# EAGLE design 5vdcdc 2.0 (EAGLE 7.2.0)
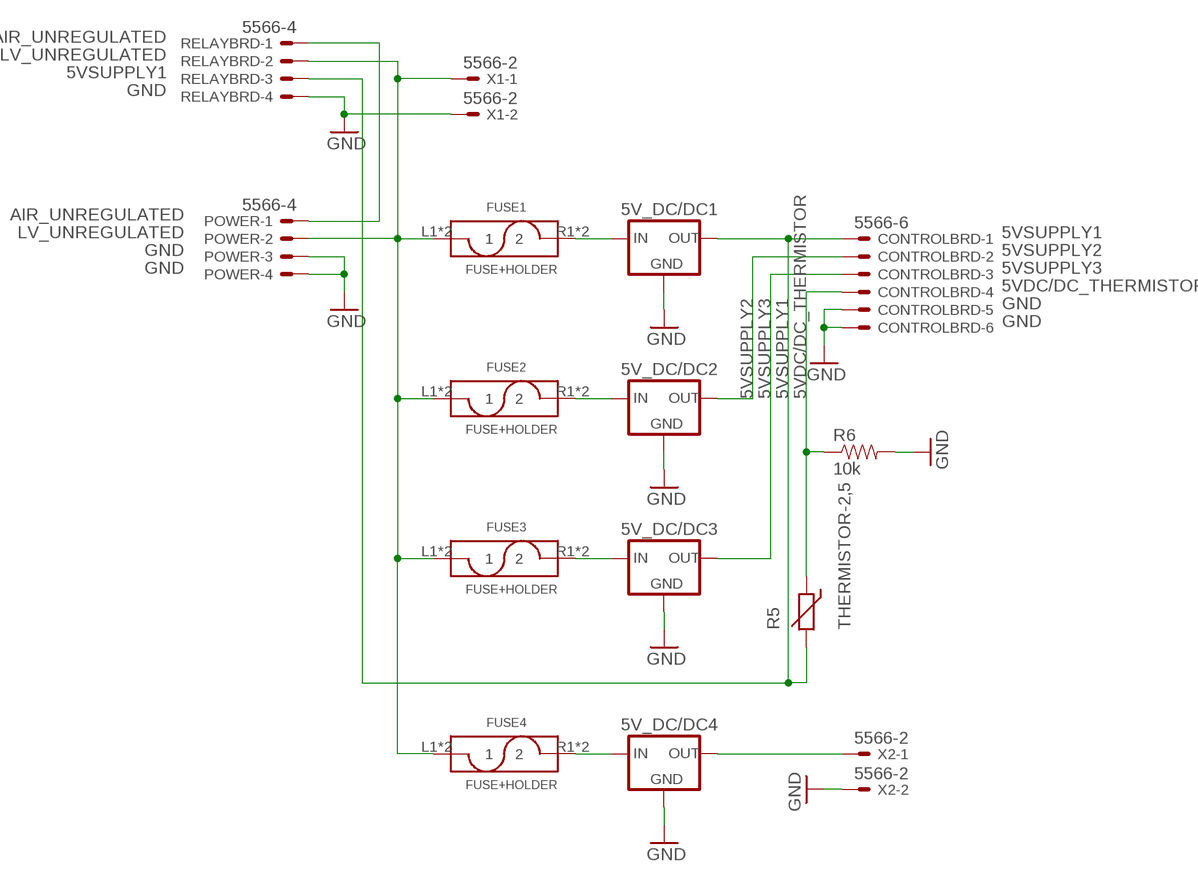
[diagram p0: schematic, sheet 1]

## Parts
5V_DC/DC1  5V_REGULATORLINEAR  [TO-220-SINK]
5V_DC/DC2  5V_REGULATORLINEAR  [TO-220-SINK]
5V_DC/DC3  5V_REGULATORLINEAR  [TO-220-SINK]
5V_DC/DC4  5V_REGULATORLINEAR  [TO-220-SINK]
CONTROLBRD  5566-6  [5566-6]
FUSE1  FUSE+HOLDER  [FUSE-HOLDER]
FUSE2  FUSE+HOLDER  [FUSE-HOLDER]
FUSE3  FUSE+HOLDER  [FUSE-HOLDER]
FUSE4  FUSE+HOLDER  [FUSE-HOLDER]
POWER  5566-4  [5566-4]
R5  THERMISTOR-2,5  [RS-2,5]
R6  10k  RESISTORAXIAL-0.3  [AXIAL-0.3]
RELAYBRD  5566-4  [5566-4]
X1  5566-2  [5566-2]
X2  5566-2  [5566-2]

## Nets
5VDC/DC_THERMISTOR: CONTROLBRD.4 R5.1 R6.P$1
5VSUPPLY1: 5V_DC/DC1.3(OUT) CONTROLBRD.1 R5.2 RELAYBRD.3
5VSUPPLY2: 5V_DC/DC2.3(OUT) CONTROLBRD.2
5VSUPPLY3: 5V_DC/DC3.3(OUT) CONTROLBRD.3
AIR_UNREGULATED: POWER.1 RELAYBRD.1
GND: 5V_DC/DC1.2(GND) 5V_DC/DC2.2(GND) 5V_DC/DC3.2(GND) 5V_DC/DC4.2(GND) CONTROLBRD.5 CONTROLBRD.6 POWER.3 POWER.4 R6.P$2 RELAYBRD.4 X1.2 X2.2
LV_UNREGULATED: FUSE1.L1 FUSE1.L2 FUSE2.L1 FUSE2.L2 FUSE3.L1 FUSE3.L2 FUSE4.L1 FUSE4.L2 POWER.2 RELAYBRD.2 X1.1
N$1: 5V_DC/DC1.1(IN) FUSE1.R1 FUSE1.R2
N$2: 5V_DC/DC2.1(IN) FUSE2.R1 FUSE2.R2
N$3: 5V_DC/DC3.1(IN) FUSE3.R1 FUSE3.R2
N$5: 5V_DC/DC4.1(IN) FUSE4.R1 FUSE4.R2
N$6: 5V_DC/DC4.3(OUT) X2.1

## Library data of the parts
5V_DC/DC1-5V_DC/DC4 = HyTech 2016:5V_REGULATOR: Voltage Regulator Switching 5v regulator Datasheet <http://power.murata.com/data/power/oki-78sr.pdf> Standard 7805 5V regulator. IGO (Input Ground Output). Spark Fun Electronics SKU : COM-00107 Datasheet <http://www.mouser.com/ds/2/308/MC7800-D-94905.pdf>
CONTROLBRD = con-molex:5566-6: Mini FIT connector 6 pol Source: http://www.molex.com; MPN: 95566-61002; OC_FARNELL: unknown; OC_NEWARK: 22K8620
FUSE1-FUSE4 = HyTech 2016:FUSE+HOLDER
POWER RELAYBRD = con-molex:5566-4: Mini FIT connector 4 pol Source: http://www.molex.com; OC_FARNELL: unknown; OC_NEWARK: unknown
R5 = varistor:THERMISTOR: THERMISTOR
R6 = HyTech 2016:RESISTOR: Resistor Basic schematic elements and footprints for 0603, 1206, and PTH resistors.
X1 X2 = con-molex:5566-2: Mini FIT connector 2 pol Source: http://www.molex.com; OC_FARNELL: 1822072; OC_NEWARK: unknown

## Board
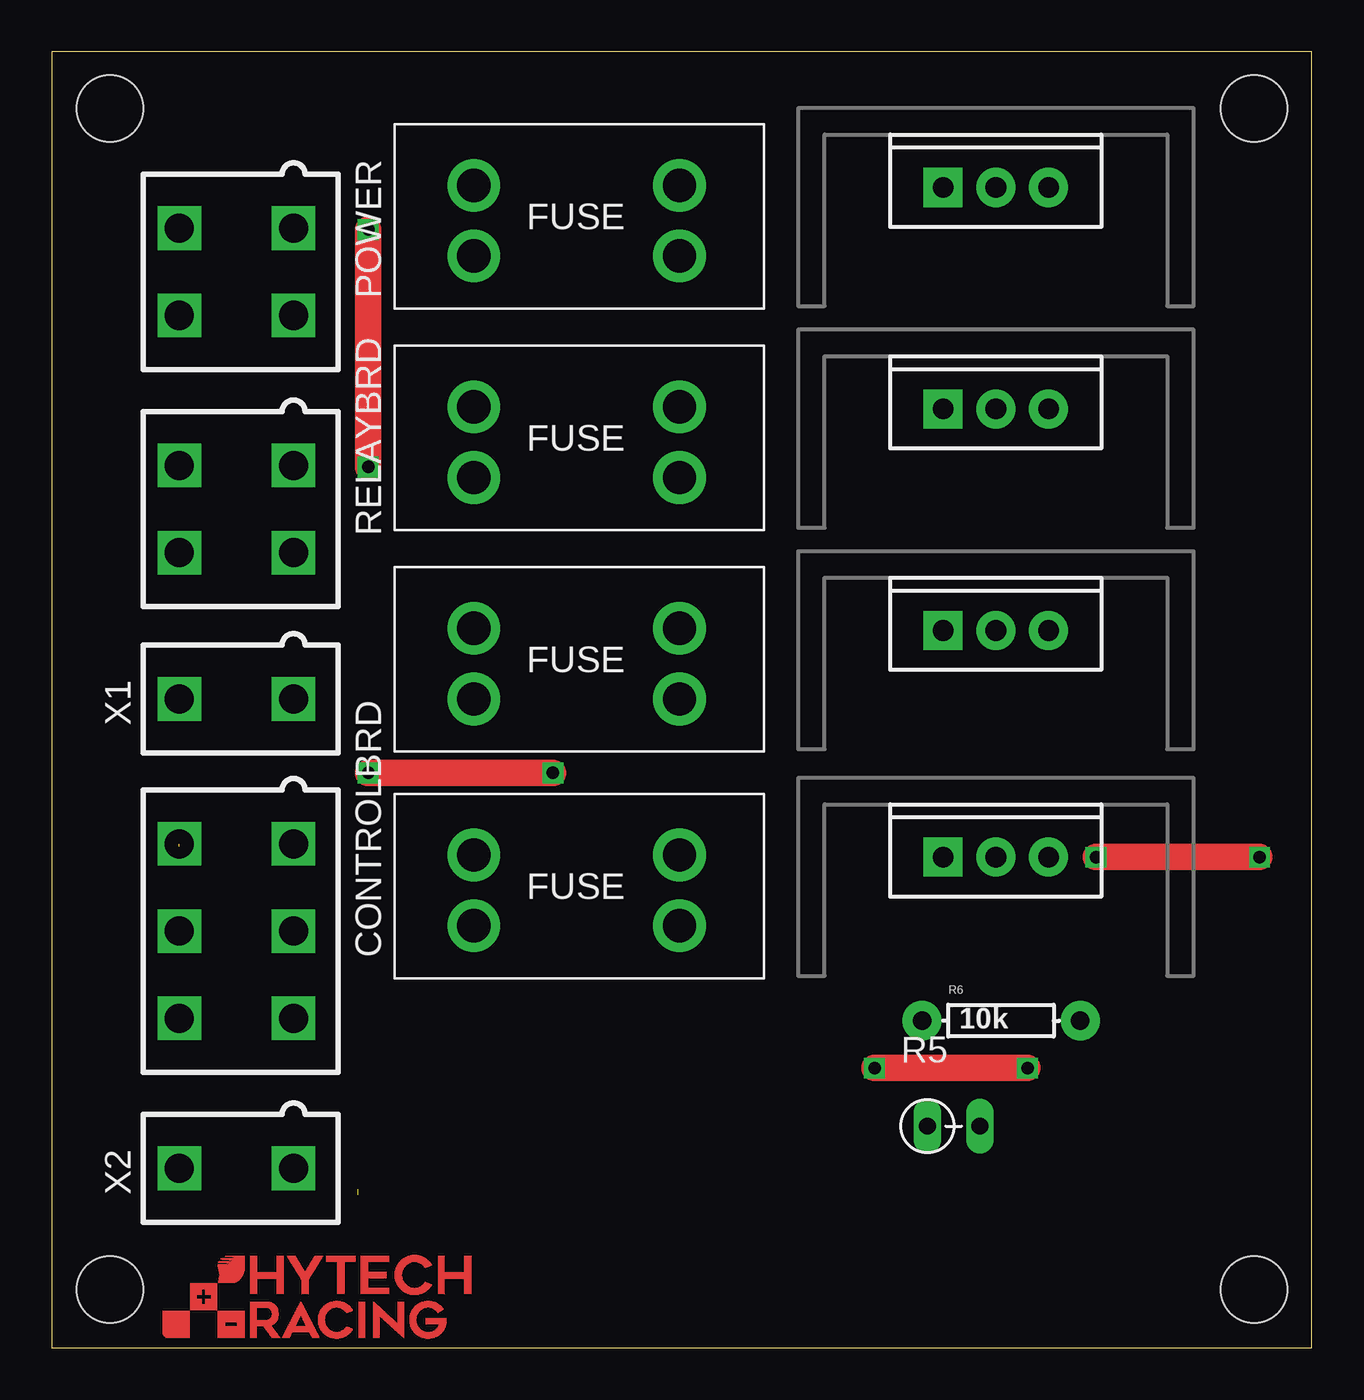
[diagram p1: board, top side]
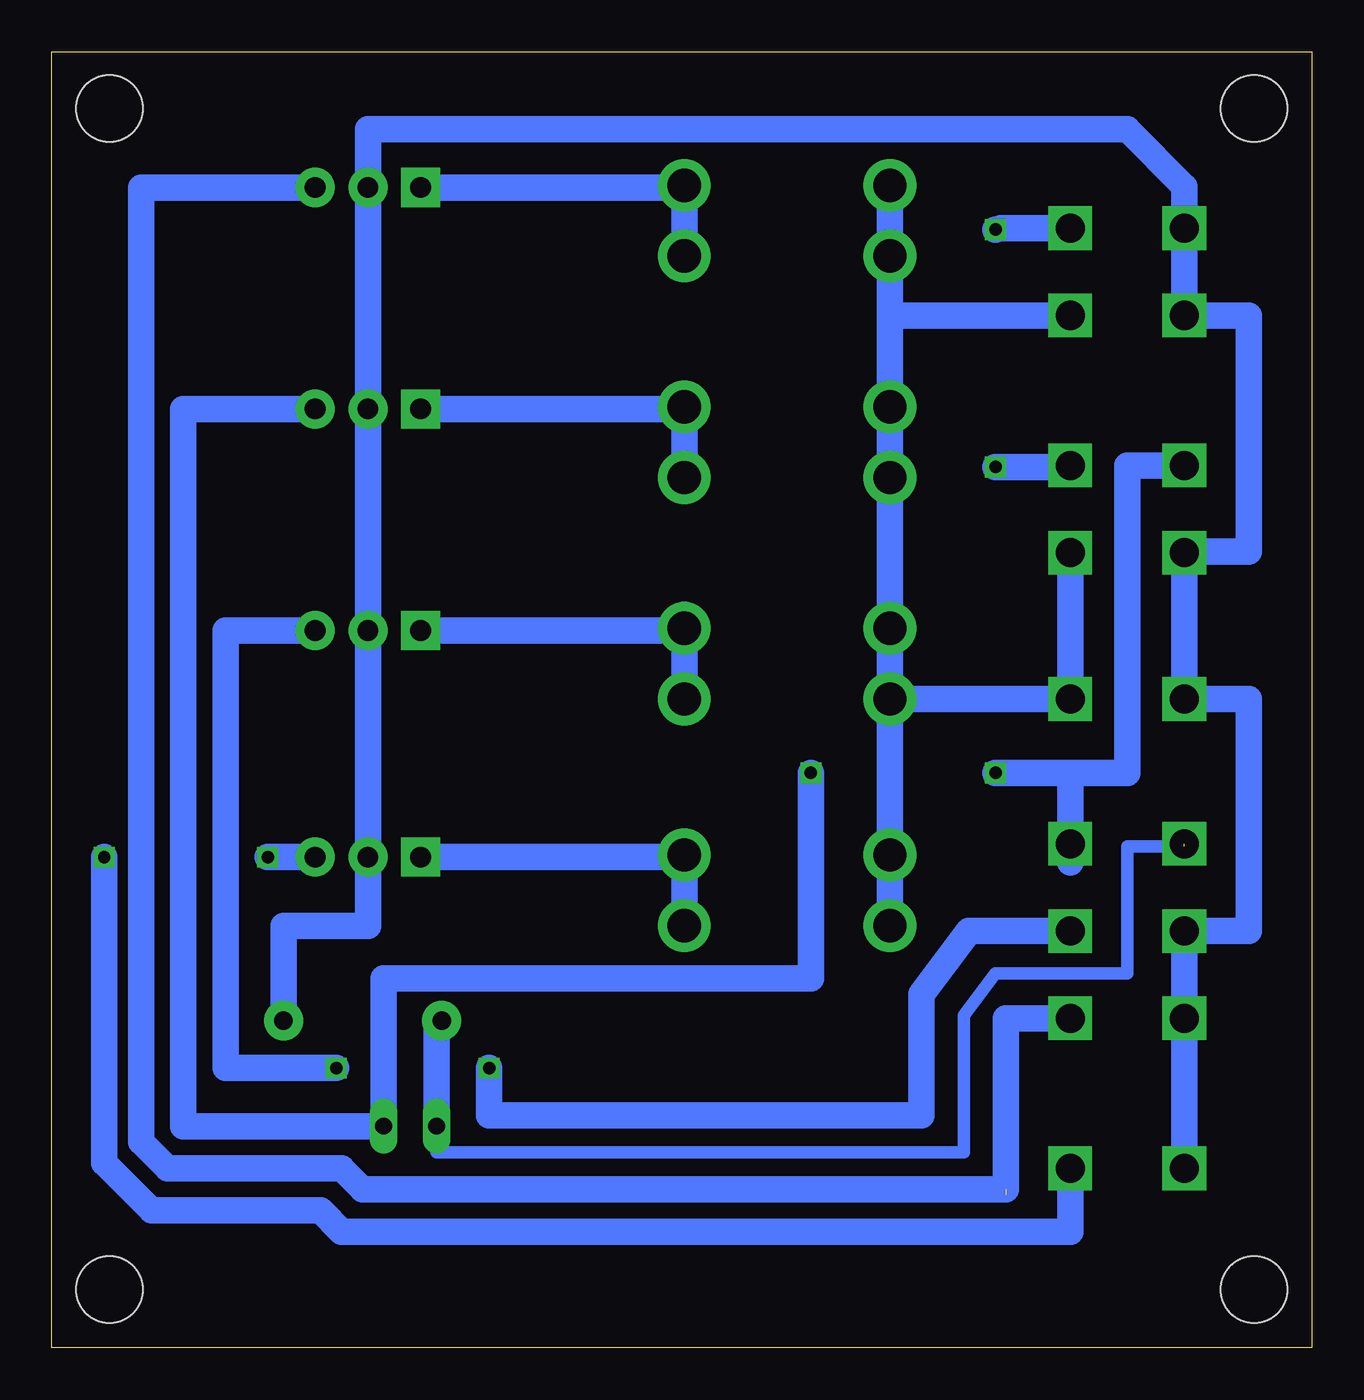
[diagram p2: board, bottom side, seen from below]

Size 60.69 x 62.41 mm. Coordinates in mm from the lower left corner, seen from the top.
Outline: 0,0 60.69,0 60.69,62.41 0,62.41 0,0
Copper layers (1*16): Top 0.035mm / dielectric 1.5mm / Bottom 0.035mm
Design rules "default": minimum track width 10mil, minimum drill 24mil, track to track 8mil, track to pad 8mil, pad to pad 8mil, via to via 8mil, smd to smd 8mil, copper to edge 40mil, drill to drill 8mil, minimum pad ring 10mil, minimum via ring 8mil, stop-mask expansion 4mil, vias tented up to drill 0mil, thermal gap 10mil
Holes 3.2 mm at 2.79,59.69 57.91,59.69 57.91,2.79 2.79,2.79

### Footprints (pad centres in the part's own frame; a part is rotated, then mirrored left to right if it is on the bottom)
TO-220-SINK = drill 1 pad 1.88 square: 1 -2.54,0 | drill 1 pad 1.88: 2 0,0; 3 2.54,0
5566-6 = drill 1.4 square: 1 4.2,-2.75; 2 0,-2.75; 3 -4.2,-2.75; 4 4.2,2.75; 5 0,2.75; 6 -4.2,2.75
FUSE-HOLDER = drill 1.6 pad 2.54: L1 0,3.404; L2 0,0; R1 9.906,3.404; R2 9.906,0
5566-4 = drill 1.4 square: 1 2.1,-2.75; 2 -2.1,-2.75; 3 2.1,2.75; 4 -2.1,2.75
RS-2,5 = drill 0.813 long: 1 -1.27,0; 2 1.27,0
AXIAL-0.3 = drill 0.9 pad 1.88: P$1 -3.81,0; P$2 3.81,0
5566-2 = drill 1.4 square: 1 0,-2.75; 2 0,2.75

### Placement (x,y rotation side)
5V_DC/DC1  45.47,45.21 0 top
5V_DC/DC2  45.47,34.54 0 top
5V_DC/DC3  45.47,55.88 0 top
5V_DC/DC4  45.47,23.62 0 top
CONTROLBRD  8.89,20.07 90 top
FUSE1  20.32,41.91 0 top
FUSE2  20.32,31.24 0 top
FUSE3  20.32,52.58 0 top
FUSE4  20.32,20.32 0 top
POWER  8.89,51.82 90 top
R5  43.43,10.67 0 top
R6  45.72,15.75 0 top
RELAYBRD  8.89,40.39 90 top
X1  8.89,31.24 90 top
X2  8.89,8.64 90 top

### Tracks (layer width: path | path; a pad name or v marks a point on that pad's centre or on a via)
5VDC/DC_THERMISTOR  (1 unrouted)
  Bottom 0.61: 6.14,24.13 8.89,24.13 8.89,18.03 15.24,18.03 16.76,16 16.76,9.4 42.16,9.4 R5.1
  Bottom 1.27: R6.P$1 42.16,15.75 R5.1
5VSUPPLY1  (via drill 0.6)
  Top 1.27: v24.13,27.69 v15.24,27.69
  Bottom 1.27: RELAYBRD.3 8.89,42.49 8.89,27.69 11.64,27.69 | 11.64,23.37 CONTROLBRD.1 11.64,27.69 | 5V_DC/DC1.3 54.36,45.21 54.36,10.67 R5.2 44.7,17.78 24.13,17.78 v24.13,27.69 | v15.24,27.69 11.64,27.69
5VSUPPLY2  (via drill 0.6)
  Top 1.27: v46.99,13.46 v39.62,13.46
  Bottom 1.27: 5V_DC/DC2.3 52.32,34.54 52.32,13.46 v46.99,13.46 | v39.62,13.46 39.62,11.18 18.8,11.18 18.8,17.02 16.51,20.07 CONTROLBRD.2
5VSUPPLY3  (1 unrouted)
  Bottom 1.27: 5V_DC/DC3.3 56.39,55.88 56.39,9.91 55.12,8.64 46.74,8.64 45.72,7.62 14.73,7.62 14.73,15.87 CONTROLBRD.3
AIR_UNREGULATED  (via drill 0.6)
  Top 1.27: v15.24,53.85 v15.24,42.42
  Bottom 1.27: POWER.1 14.99,53.92 v15.24,53.85 | v15.24,42.42 11.64,42.42 RELAYBRD.1
GND
  Bottom 1.27: X2.2 CONTROLBRD.6 CONTROLBRD.5 3.05,20.07 3.05,31.24 X1.2 RELAYBRD.4 6.14,38.35 3.05,38.35 3.05,49.72 POWER.4 POWER.3 6.14,55.92 8.89,58.67 45.47,58.67 5V_DC/DC3.2 5V_DC/DC1.2 5V_DC/DC2.2 5V_DC/DC4.2 45.47,20.32 49.53,20.32 R6.P$2
LV_UNREGULATED
  Bottom 1.27: FUSE3.L1 FUSE3.L2 20.32,49.72 | 20.32,49.72 FUSE1.L1 FUSE1.L2 FUSE2.L1 FUSE2.L2 | RELAYBRD.2 X1.1 FUSE2.L2 | POWER.2 20.32,49.72 | FUSE4.L2 FUSE4.L1 FUSE2.L2
N$1
  Bottom 1.27: FUSE1.R1 FUSE1.R2 | 30.23,45.72 FUSE1.R1 | 5V_DC/DC1.1 30.23,45.21 FUSE1.R1
N$2
  Bottom 1.27: FUSE2.R1 FUSE2.R2 | 30.23,35.31 FUSE2.R1 | 5V_DC/DC2.1 30.23,34.54 FUSE2.R1
N$3
  Bottom 1.27: FUSE3.R1 30.23,56.13 | FUSE3.R1 FUSE3.R2 | 5V_DC/DC3.1 30.23,55.88 FUSE3.R1
N$5
  Bottom 1.27: FUSE4.R1 FUSE4.R2 | 30.23,23.37 FUSE4.R1 | 5V_DC/DC4.1 30.23,23.62 FUSE4.R1
N$6  (via drill 0.6)
  Top 1.27: v50.29,23.62 v58.17,23.62
  Bottom 1.27: 5V_DC/DC4.3 v50.29,23.62 | X2.1 11.64,5.59 46.74,5.59 47.75,6.6 55.88,6.6 58.17,8.89 v58.17,23.62
(copper drawn outside any net)
  shapes: Top area x2493